# EAGLE design Rotary Dial v1_0 (EAGLE 7.4.0)
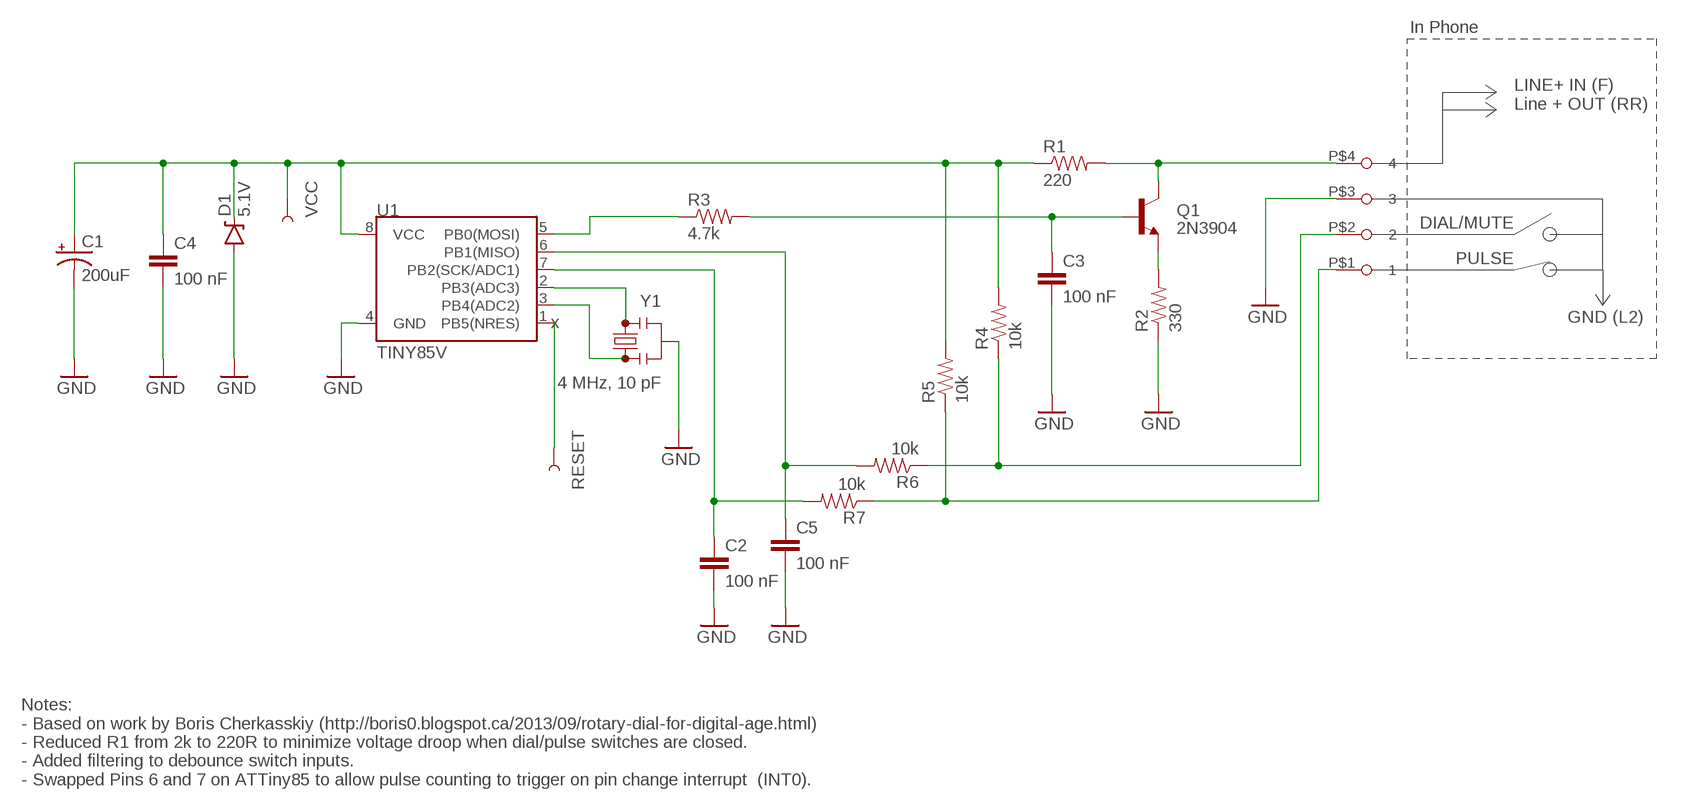
[diagram p0: schematic, sheet 1]

## Parts
C1  200uF  100UF-25V-20%(PTH)  [CPOL-RADIAL-100UF-25V]
C2  100 nF  CAPPTH  [CAP-PTH-SMALL]
C3  100 nF  CAPPTH  [CAP-PTH-SMALL]
C4  100 nF  CAPPTH  [CAP-PTH-SMALL]
C5  100 nF  CAPPTH  [CAP-PTH-SMALL]
D1  5.1V  DIODE-ZENERPTH  [DIODE-ZENER]
J1  SCREW_TERMINAL_4  [.325_TERMINAL_4-PIN]
Q1  2N3904  TRANSISTOR_NPNTO-92-AMMO  [TO-92-AMMO]
R1  220  RESISTORPTH-1/4W-VERT  [AXIAL-0.1]
R2  330  RESISTORPTH-1/4W-VERT  [AXIAL-0.1]
R3  4.7k  RESISTORPTH-1/4W-VERT  [AXIAL-0.1]
R4  10k  RESISTORPTH-1/4W-VERT  [AXIAL-0.1]
R5  10k  RESISTORPTH-1/4W-VERT  [AXIAL-0.1]
R6  10k  RESISTORPTH-1/4W-VERT  [AXIAL-0.1]
R7  10k  RESISTORPTH-1/4W-VERT  [AXIAL-0.1]
RESET  TEST-POINTTP_15TH_THRU  [TP_15TH]
U1  TINY85V  ATTINY45TINY85-20-DIP  [DIP08]
VCC  TEST-POINTTP_15TH_THRU  [TP_15TH]
Y1  4 MHz, 10 pF  RESONATORPTH  [RESONATOR-PTH]

## Nets
DIAL/MUTE: J1.P$2 R4.P$1 R6.P$1
DTMF: R3.P$1 U1.5(PB0(MOSI))
DTMF': C3.1 Q1.2(B) R3.P$2
GND: C1.2(-) C2.2 C3.2 C4.2 C5.2 D1.P$2(A) J1.P$3 R2.P$1 U1.4(GND) Y1.2
LINE_IN: J1.P$4 Q1.3(C) R1.P$2
MUTE/DIAL': C5.1 R6.P$2 U1.6(PB1(MISO))
N$2: Q1.1(E) R2.P$2
N$5: U1.2(PB3(ADC3)) Y1.3
N$6: U1.3(PB4(ADC2)) Y1.1
PULSE: J1.P$1 R5.P$1 R7.P$1
PULSE': C2.1 R7.P$2 U1.7(PB2(SCK/ADC1))
RESET: RESET.P$1 U1.1(PB5(NRES))
VCC: C1.1(+) C4.1 D1.P$1(C) R1.P$1 R4.P$2 R5.P$2 U1.8(VCC) VCC.P$1

## Notes on the sheet
- In Phone
- LINE+ IN (F)
  Line + OUT (RR)
- DIAL/MUTE
- PULSE
- GND (L2)
- x
- Notes:
  - Based on work by Boris Cherkasskiy (http://boris0.blogspot.ca/2013/09/rotary-dial-for-digital-age.html)
  - Reduced R1 from 2k to 220R to minimize voltage droop when dial/pulse switches are closed.
  - Added filtering to debounce switch inputs.
  - Swapped Pins 6 and 7 on ATTiny85 to allow pulse counting to trigger on pin change interrupt  (INT0).

## Library data of the parts
C1 = SparkFun-Capacitors:100UF-25V-20%(PTH): CAP-08439; PROD_ID: CAP-08439
C2-C5 = SparkFun-Capacitors:CAP: Capacitor Standard 0603 ceramic capacitor, and 0.1" leaded capacitor.
D1 = SparkFun-DiscreteSemi:DIODE-ZENER: Zener Diode Production Part - 8199 3.4V Zener Voltage
J1 = Arnie:SCREW_TERMINAL_4: 4-pin Barrier/Terminal Block http://www.on-shore.com/sites/default/files/manuals/ostyk421xx030.pdf
Q1 = SparkFun-DiscreteSemi:TRANSISTOR_NPN: Generic NPN BJT MMBT2222A - TRANS-08049 (SOT-23, 1A 40V) MPSA42 - TRANS-09116 (SOT-23, 500mA 300V) MMBT5088LT1G - TRANS-11160 (SOT-23, 50 mA 30V) BC547 - COM-08928 <http://www.sparkfun.com/products/8928> (TO-92 45V 100mA) (1.Collector 2.Base 3.Emitter) 2N3904 - COM-00521 <http://www.sparkfun.com/products/521> (TO-92 40V 200mA) (1.Emitter 2.Base 3.Collector) P2N2222A - COM-12852 <http://www.sparkfun.com/products/12852> (TO-92 40V 600mA) (1.Collector 2.Base 3.Emitter)
R1-R7 = SparkFun-Resistors:RESISTOR: Resistor Basic schematic elements and footprints for 0603, 1206, and PTH resistors.
RESET VCC = SparkFun-Passives:TEST-POINT: Bare copper test points for troubleshooting or ICT
U1 = SparkFun-DigitalIC:ATTINY45: Atmel 8-pin 2/4/8kB flash uC; PROD_ID: IC-09445; VALUE: TINY85-20-DIP
Y1 = SparkFun-FreqCtrl:RESONATOR: Resonator Small SMD resonator. Used, eg, on the Arduino Pro/ Pro Mini boards. 8MHz- XTAL-08895 16MHz- XTAL-08900

## Board
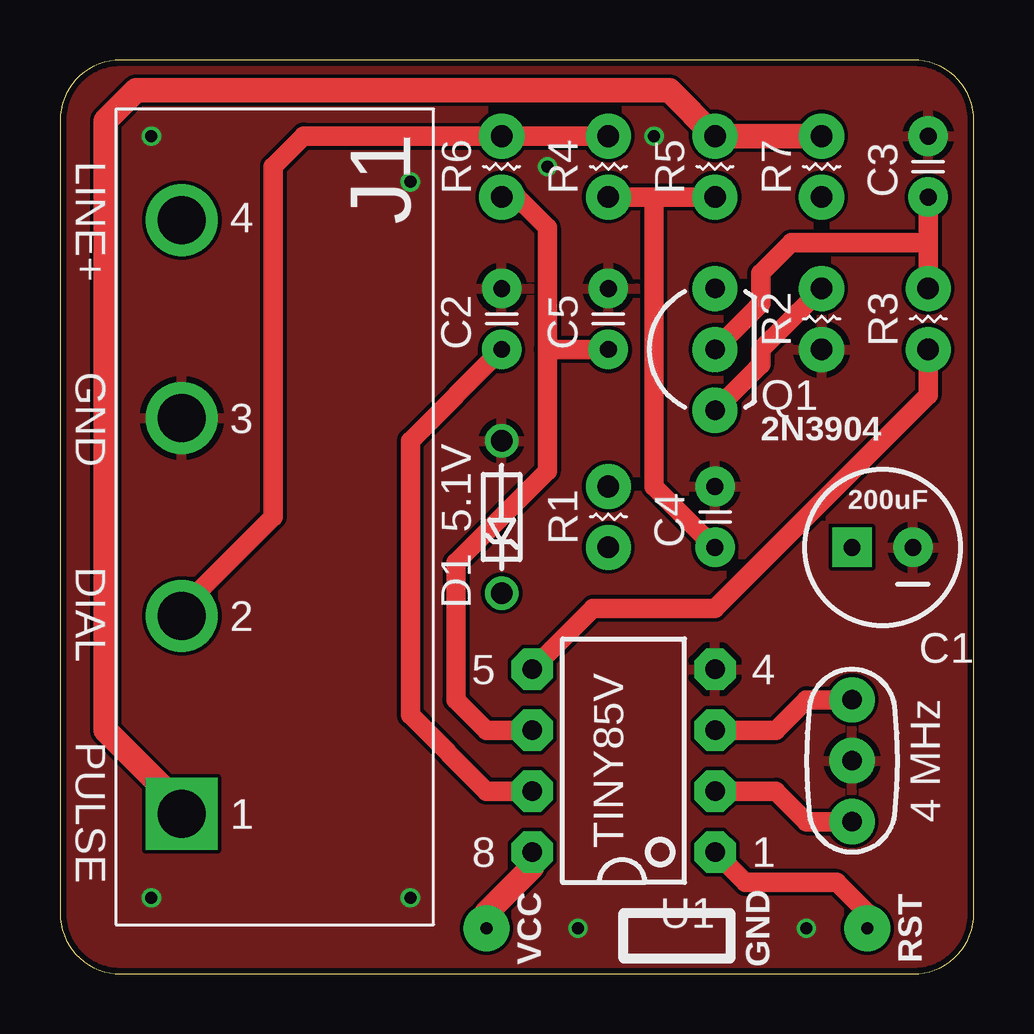
[diagram p1: board, top side]
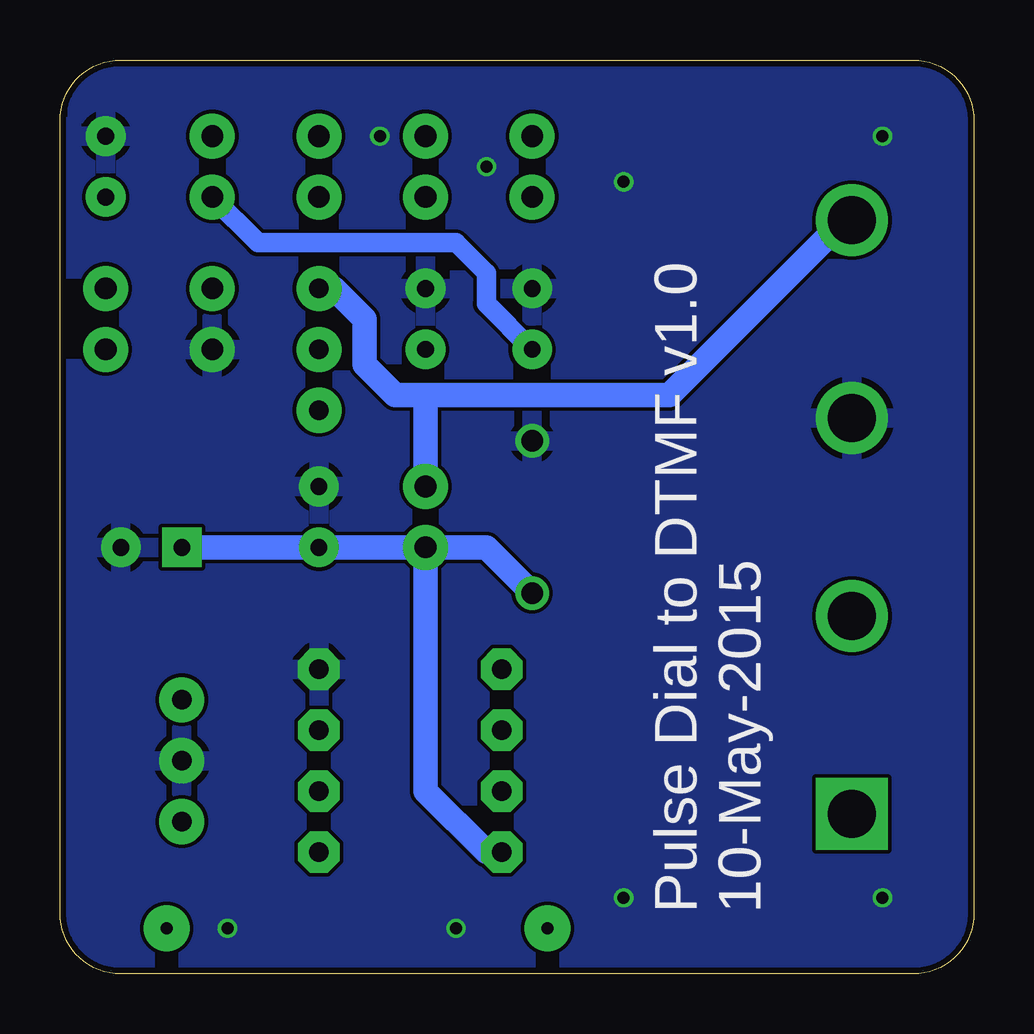
[diagram p2: board, bottom side, seen from below]

Size 38.1 x 38.1 mm. Coordinates in mm from the lower left corner, seen from the top.
Outline: 0,35.56 0,2.54 arc90 2.54,0 35.56,0 arc90 38.1,2.54 38.1,35.56 arc90 35.56,38.1 2.54,38.1 arc90 0,35.56
Copper layers (1*16): Top 0.035mm / dielectric 1.5mm / Bottom 0.035mm
Design rules "ITEADstudio_DRC": minimum track width 6mil, minimum drill 12mil, track to track 6mil, track to pad 6mil, pad to pad 6mil, via to via 6mil, smd to smd 0mil, copper to edge 10mil, drill to drill 10mil, minimum pad ring 10mil, minimum via ring 6mil, stop-mask expansion 2mil, vias tented up to drill 100mil, thermal gap 10mil

### Footprints (pad centres in the part's own frame; a part is rotated, then mirrored left to right if it is on the bottom)
CPOL-RADIAL-100UF-25V = drill 0.7 pad 1.651 square: 1 1.27,0 | drill 0.7 pad 1.651: 2 -1.27,0
CAP-PTH-SMALL = drill 0.7 pad 1.651: 1 0,0; 2 2.54,0
DIODE-ZENER = drill 0.9: P$1 -3.175,0; P$2 3.175,0
.325_TERMINAL_4-PIN = drill 2 square: P$1 0,12.375 | drill 2: P$2 0,4.125; P$3 0,-4.125; P$4 0,-12.375
TO-92-AMMO = drill 0.813 pad 1.88: 1 -2.54,0; 2 0,0; 3 2.54,0
AXIAL-0.1 = drill 0.9 pad 1.88: P$1 0,0; P$2 2.54,0
TP_15TH = drill 0.5 pad 1.905: P$1 0,0
DIP08 = drill 0.813 pad 1.727 octagon: 1 -3.81,-3.81; 2 -1.27,-3.81; 3 1.27,-3.81; 4 3.81,-3.81; 5 3.81,3.81; 6 1.27,3.81; 7 -1.27,3.81; 8 -3.81,3.81
RESONATOR-PTH = drill 0.8 pad 1.88: 1 -2.54,0; 2 0,0; 3 2.54,0

### Placement (x,y rotation side)
C1  34.29,17.78 180 top
C2  18.41,26.04 90 top
C3  36.2,32.38 90 top
C4  27.3,17.78 90 top
C5  22.86,26.04 90 top
D1  18.41,19.05 90 top
J1  5.08,19.05 180 top
Q1  27.3,26.04 90 top
R1  22.86,17.78 90 top
R2  31.75,26.04 90 top
R3  36.2,26.04 90 top
R4  22.86,34.92 270 top
R5  27.3,34.92 270 top
R6  18.41,34.92 270 top
R7  31.75,34.92 270 top
RESET  33.66,1.91 0 top
U1  23.5,8.89 90 top
VCC  17.78,1.91 0 top
Y1  33.02,8.89 270 top

### Tracks (layer width: path | path; a pad name or v marks a point on that pad's centre or on a via)
DIAL/MUTE
  Top 0.813: R4.P$1 R6.P$1 10.16,34.92 8.89,33.66 8.89,19.05 5.08,15.24 J1.P$2
DTMF
  Top 0.813: R3.P$1 36.2,24.13 27.3,15.24 22.23,15.24 U1.5
DTMF'
  Top 0.813: Q1.2 29.21,27.94 29.21,29.21 30.48,30.48 36.2,30.48 | C3.1 36.2,30.48 | 36.2,30.48 R3.P$2
GND  (via drill 0.5)
  other vias: 24.77,34.92 3.81,34.92 14.61,3.17 3.81,3.17 31.11,1.91 21.59,1.91 14.61,33.02 20.32,33.66
  pour Top: 38.1,35.56 38.1,2.54 arc-90 35.56,0 2.54,0 arc-90 0,2.54 0,35.56 arc-90 2.54,38.1 35.56,38.1 arc-90
  pour Bottom: 38.1,35.56 38.1,2.54 arc-90 35.56,0 2.54,0 arc-90 0,2.54 0,35.56 arc-90 2.54,38.1 35.56,38.1 arc-90
LINE_IN
  Bottom 1.016: 22.86,24.13 12.7,24.13 5.41,31.43 J1.P$4 | 22.86,24.13 24.13,24.13 25.4,25.4 25.4,27.3 26.67,28.57 Q1.3 | R1.P$2 22.86,24.13
MUTE/DIAL'
  Top 0.813: U1.6 17.78,10.16 16.51,11.43 16.51,17.14 20.32,20.95 20.32,26.04 | R6.P$2 19.05,32.38 20.32,31.11 20.32,26.04 | C5.1 20.32,26.04
N$2
  Top 0.813: R2.P$2 29.21,26.04 29.21,25.4 Q1.1
N$5
  Top 0.813: U1.2 29.84,7.62 31.11,6.35 Y1.3
N$6
  Top 0.813: U1.3 29.84,10.16 31.11,11.43 Y1.1
PULSE
  Top 1.016: R7.P$1 R5.P$1 25.4,36.83 3.17,36.83 1.91,35.56 1.91,10.16 5.08,6.99 J1.P$1
PULSE'
  Top 0.813: U1.7 17.78,7.62 14.61,10.79 14.61,22.23 C2.1
  Bottom 0.813: R7.P$2 29.84,30.48 21.59,30.48 20.32,29.21 20.32,27.94 C2.1
RESET
  Top 0.813: RESET.P$1 33.66,2.54 32.38,3.81 28.57,3.81 U1.1
VCC
  Top 0.813: C4.1 24.77,20.32 24.77,32.38 | R5.P$2 24.77,32.38 | 24.77,32.38 R4.P$2
  Top 1.016: VCC.P$1 17.78,2.54 19.68,4.45 U1.8
  Bottom 1.016: U1.8 20.32,5.08 22.86,7.62 R1.P$1 | R1.P$1 C4.1 C1.1 | R1.P$1 20.32,17.78 D1.P$1

### Text on the board
tPlace: LINE+ | GND | DIAL | 4 MHz | PULSE | VCC | GND | RST
bPlace: Pulse Dial to DTMF v1.0 / 10-May-2015